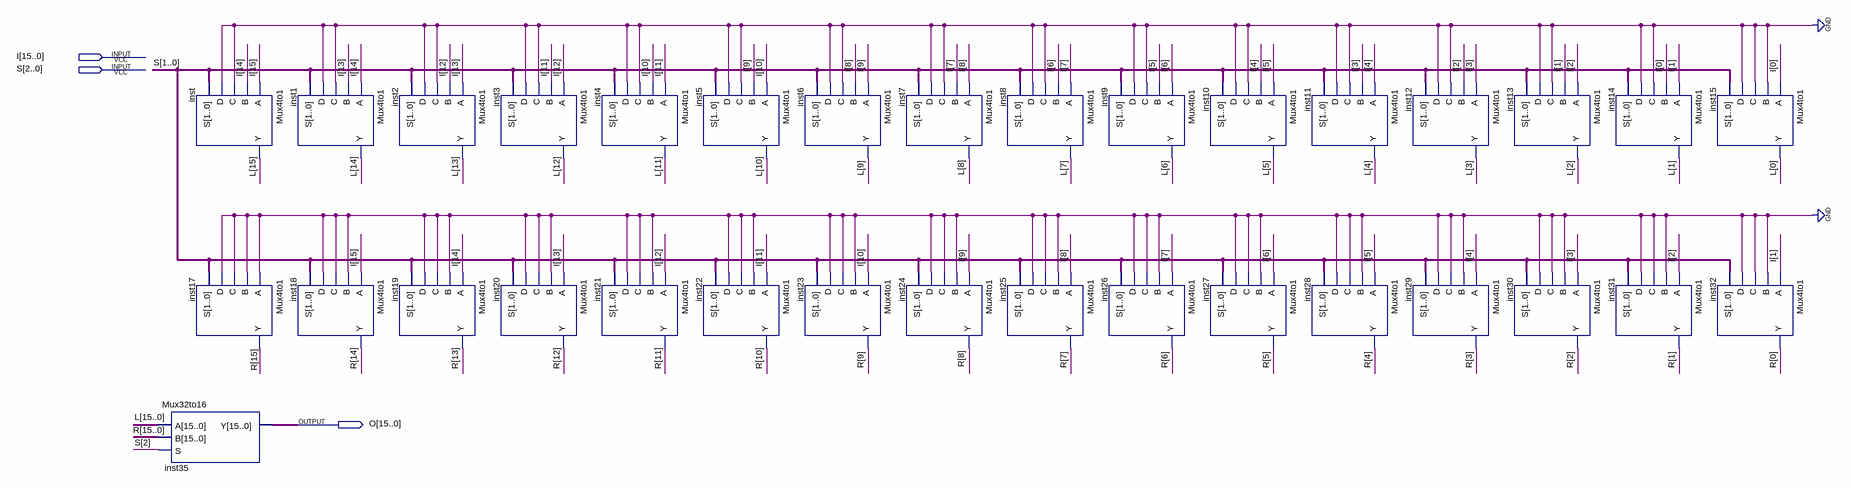
[diagram p0: schematic sheet]
// Quartus schematic Shift123.bdf as structural Verilog: 33 symbols, 3 pins
module Shift123 (
  input  [15:0] I,
  input  [2:0] S,
  output [15:0] O
);

  wire [15:0] L, R;

  Mux32to16 inst35 (.A(L), .B(R), .S(S[2]), .Y(O));
  Mux4to1 inst (.A(I[15]), .B(I[14]), .C(1'b0), .D(1'b0), .S(S[1:0]), .Y(L[15]));
  Mux4to1 inst17 (.A(1'b0), .B(1'b0), .C(1'b0), .D(1'b0), .S(S[1:0]), .Y(R[15]));
  Mux4to1 inst1 (.A(I[14]), .B(I[13]), .C(1'b0), .D(1'b0), .S(S[1:0]), .Y(L[14]));
  Mux4to1 inst18 (.A(I[15]), .B(1'b0), .C(1'b0), .D(1'b0), .S(S[1:0]), .Y(R[14]));
  Mux4to1 inst2 (.A(I[13]), .B(I[12]), .C(1'b0), .D(1'b0), .S(S[1:0]), .Y(L[13]));
  Mux4to1 inst19 (.A(I[14]), .B(1'b0), .C(1'b0), .D(1'b0), .S(S[1:0]), .Y(R[13]));
  Mux4to1 inst3 (.A(I[12]), .B(I[11]), .C(1'b0), .D(1'b0), .S(S[1:0]), .Y(L[12]));
  Mux4to1 inst20 (.A(I[13]), .B(1'b0), .C(1'b0), .D(1'b0), .S(S[1:0]), .Y(R[12]));
  Mux4to1 inst4 (.A(I[11]), .B(I[10]), .C(1'b0), .D(1'b0), .S(S[1:0]), .Y(L[11]));
  Mux4to1 inst21 (.A(I[12]), .B(1'b0), .C(1'b0), .D(1'b0), .S(S[1:0]), .Y(R[11]));
  Mux4to1 inst5 (.A(I[10]), .B(I[9]), .C(1'b0), .D(1'b0), .S(S[1:0]), .Y(L[10]));
  Mux4to1 inst22 (.A(I[11]), .B(1'b0), .C(1'b0), .D(1'b0), .S(S[1:0]), .Y(R[10]));
  Mux4to1 inst6 (.A(I[9]), .B(I[8]), .C(1'b0), .D(1'b0), .S(S[1:0]), .Y(L[9]));
  Mux4to1 inst23 (.A(I[10]), .B(1'b0), .C(1'b0), .D(1'b0), .S(S[1:0]), .Y(R[9]));
  Mux4to1 inst7 (.A(I[8]), .B(I[7]), .C(1'b0), .D(1'b0), .S(S[1:0]), .Y(L[8]));
  Mux4to1 inst24 (.A(I[9]), .B(1'b0), .C(1'b0), .D(1'b0), .S(S[1:0]), .Y(R[8]));
  Mux4to1 inst8 (.A(I[7]), .B(I[6]), .C(1'b0), .D(1'b0), .S(S[1:0]), .Y(L[7]));
  Mux4to1 inst25 (.A(I[8]), .B(1'b0), .C(1'b0), .D(1'b0), .S(S[1:0]), .Y(R[7]));
  Mux4to1 inst9 (.A(I[6]), .B(I[5]), .C(1'b0), .D(1'b0), .S(S[1:0]), .Y(L[6]));
  Mux4to1 inst26 (.A(I[7]), .B(1'b0), .C(1'b0), .D(1'b0), .S(S[1:0]), .Y(R[6]));
  Mux4to1 inst10 (.A(I[5]), .B(I[4]), .C(1'b0), .D(1'b0), .S(S[1:0]), .Y(L[5]));
  Mux4to1 inst27 (.A(I[6]), .B(1'b0), .C(1'b0), .D(1'b0), .S(S[1:0]), .Y(R[5]));
  Mux4to1 inst11 (.A(I[4]), .B(I[3]), .C(1'b0), .D(1'b0), .S(S[1:0]), .Y(L[4]));
  Mux4to1 inst28 (.A(I[5]), .B(1'b0), .C(1'b0), .D(1'b0), .S(S[1:0]), .Y(R[4]));
  Mux4to1 inst12 (.A(I[3]), .B(I[2]), .C(1'b0), .D(1'b0), .S(S[1:0]), .Y(L[3]));
  Mux4to1 inst29 (.A(I[4]), .B(1'b0), .C(1'b0), .D(1'b0), .S(S[1:0]), .Y(R[3]));
  Mux4to1 inst13 (.A(I[2]), .B(I[1]), .C(1'b0), .D(1'b0), .S(S[1:0]), .Y(L[2]));
  Mux4to1 inst30 (.A(I[3]), .B(1'b0), .C(1'b0), .D(1'b0), .S(S[1:0]), .Y(R[2]));
  Mux4to1 inst14 (.A(I[1]), .B(I[0]), .C(1'b0), .D(1'b0), .S(S[1:0]), .Y(L[1]));
  Mux4to1 inst31 (.A(I[2]), .B(1'b0), .C(1'b0), .D(1'b0), .S(S[1:0]), .Y(R[1]));
  Mux4to1 inst15 (.A(I[0]), .B(1'b0), .C(1'b0), .D(1'b0), .S(S[1:0]), .Y(L[0]));
  Mux4to1 inst32 (.A(I[1]), .B(1'b0), .C(1'b0), .D(1'b0), .S(S[1:0]), .Y(R[0]));
endmodule
